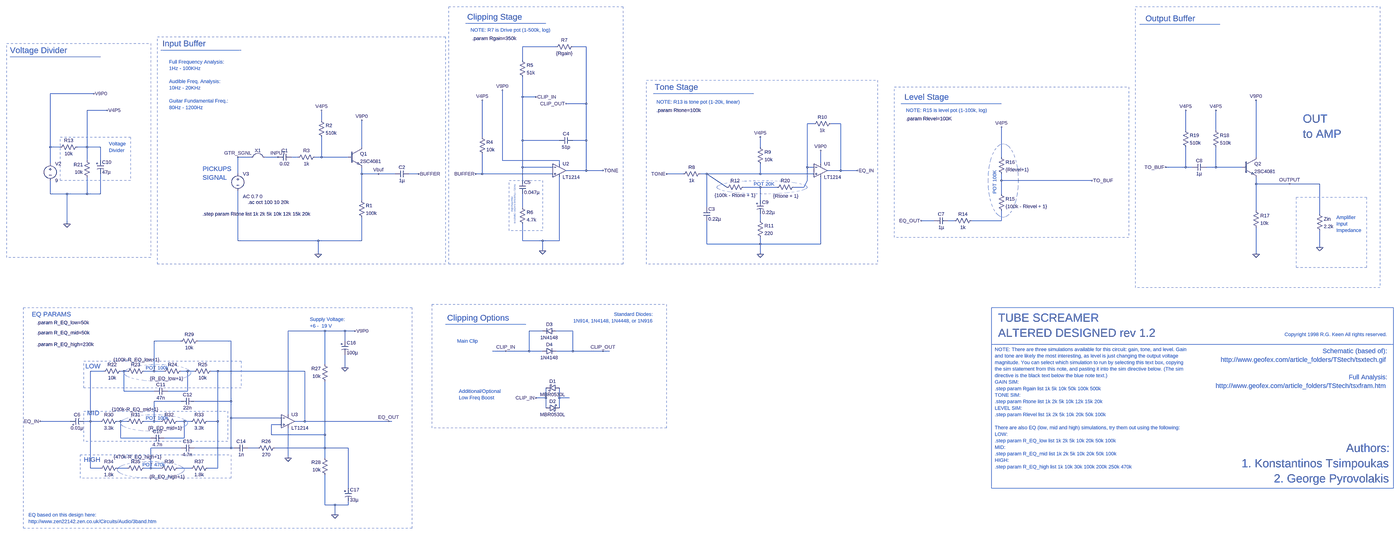
[diagram p0: schematic tube_screamer.asc, whole sheet]
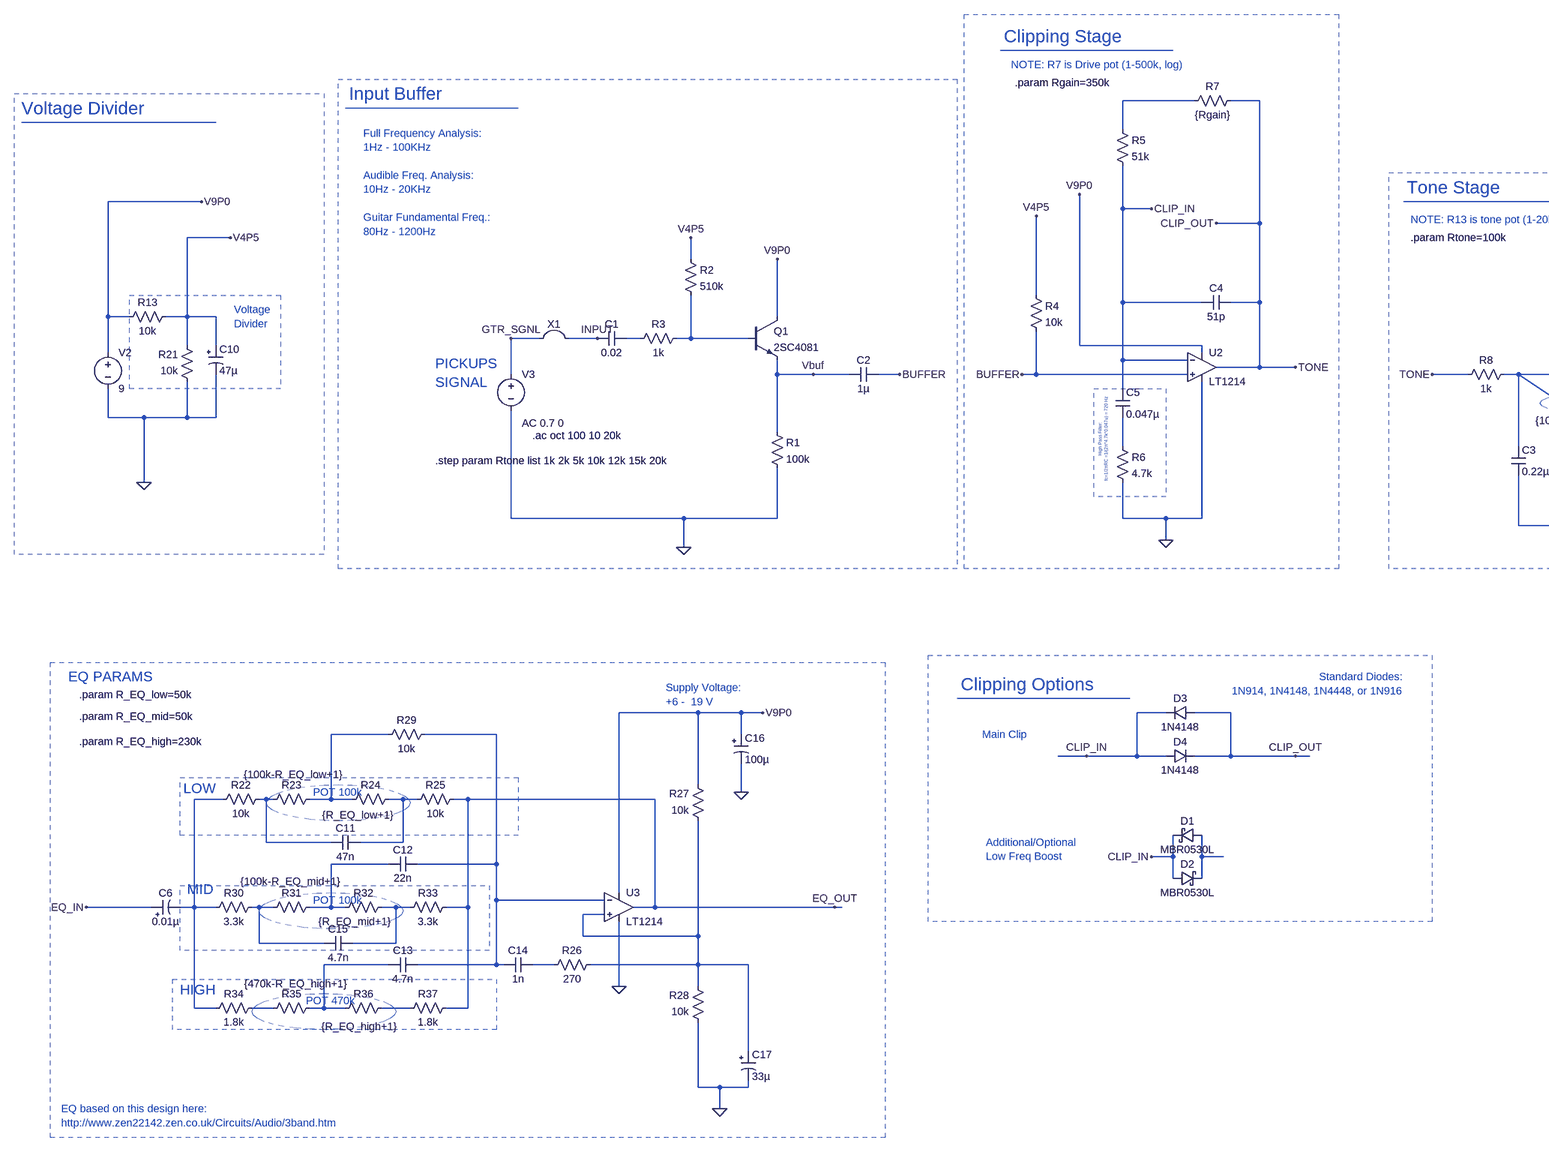
[diagram p1: schematic tube_screamer.asc, part, row 1 of 1, column 1 of 2]
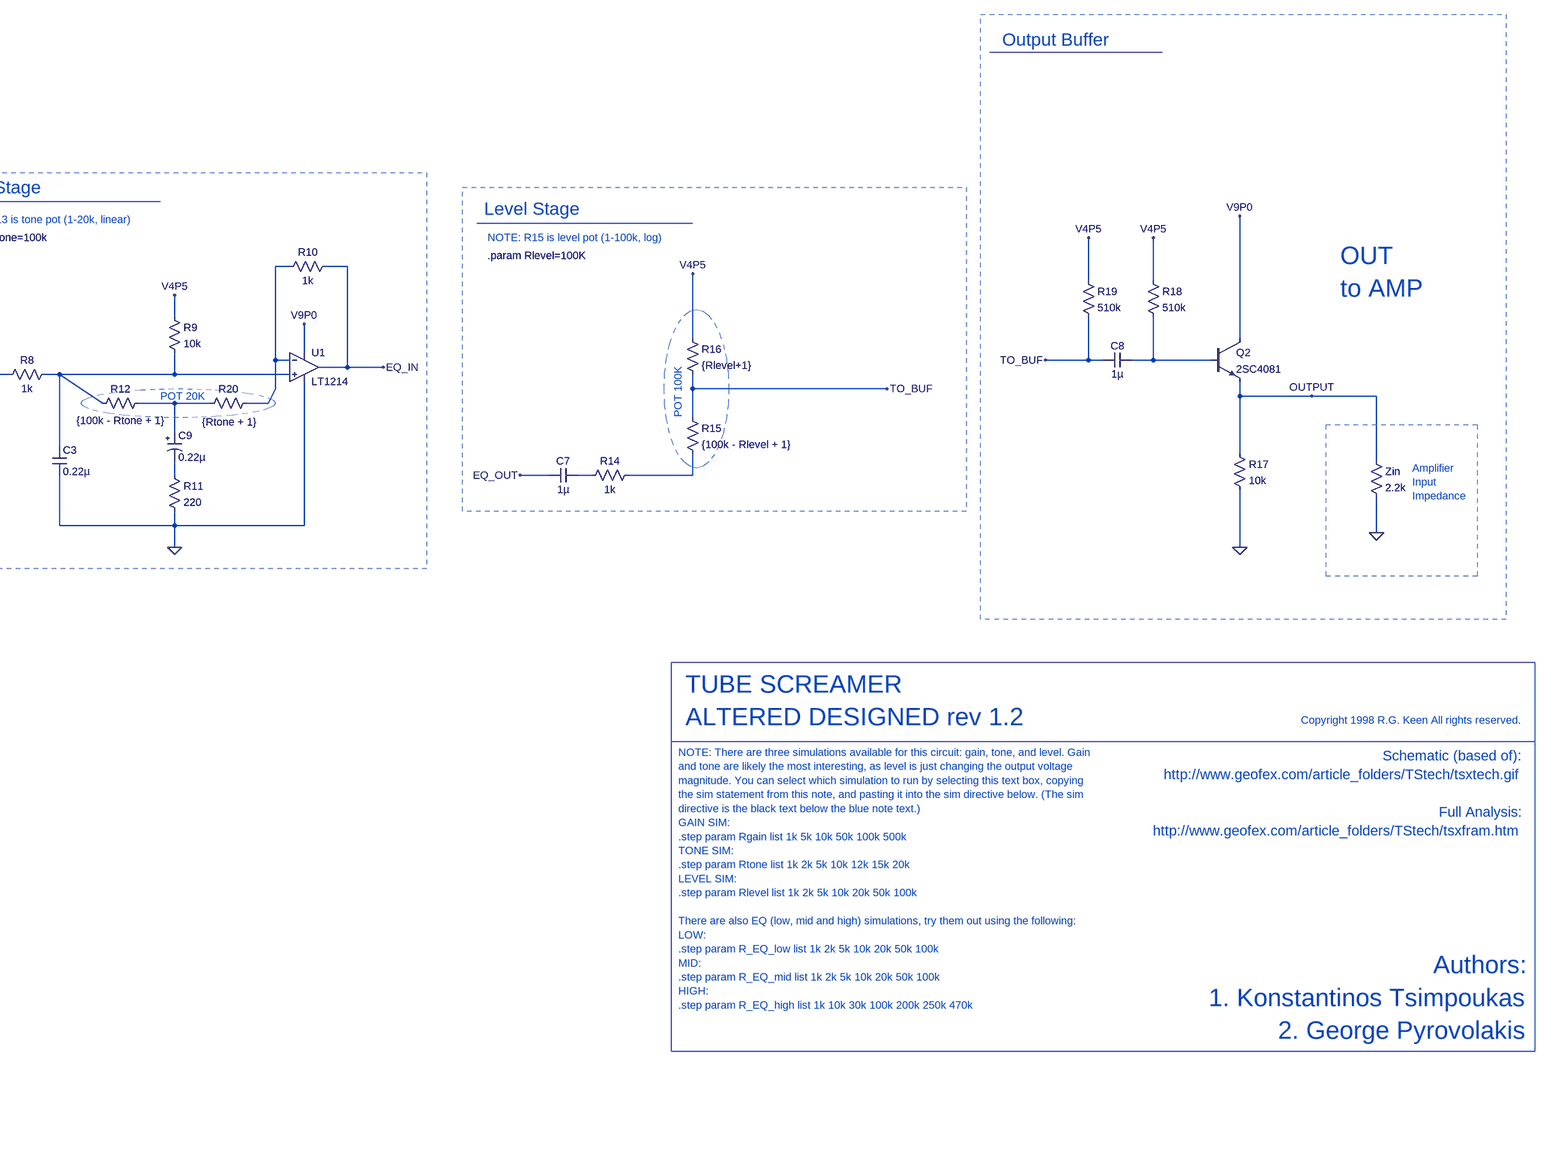
[diagram p2: schematic tube_screamer.asc, part, row 1 of 1, column 2 of 2]
tube_screamer.asc, the LTspice schematic file:
Version 4
SHEET 1 5580 4308
WIRE -1024 848 -1184 848
WIRE -880 848 -944 848
WIRE -1184 912 -1184 848
WIRE -3232 1072 -3440 1072
WIRE -1184 1088 -1184 992
WIRE -1120 1088 -1184 1088
WIRE -880 1120 -880 848
WIRE -880 1120 -976 1120
WIRE -3168 1152 -3264 1152
WIRE -2144 1200 -2144 1152
WIRE 208 1216 176 1216
WIRE 336 1216 288 1216
WIRE 1984 1248 1984 1152
WIRE 2128 1248 2128 1152
WIRE -1376 1280 -1376 1104
WIRE -1184 1296 -1184 1088
WIRE -1008 1296 -1184 1296
WIRE -880 1296 -880 1120
WIRE -880 1296 -944 1296
WIRE -3440 1328 -3440 1072
WIRE -3392 1328 -3440 1328
WIRE -3264 1328 -3264 1152
WIRE -3264 1328 -3312 1328
WIRE -3200 1328 -3264 1328
WIRE -1952 1328 -1952 1200
WIRE -48 1328 -48 1280
WIRE -2480 1376 -2544 1376
WIRE -2352 1376 -2416 1376
WIRE -2256 1376 -2288 1376
WIRE -2144 1376 -2144 1280
WIRE -2144 1376 -2176 1376
WIRE -2016 1376 -2144 1376
WIRE 1104 1376 1104 1232
WIRE 2320 1376 2320 1104
WIRE -3264 1392 -3264 1328
WIRE -3200 1392 -3200 1328
WIRE -1280 1392 -1280 1056
WIRE -1008 1392 -1280 1392
WIRE -3440 1408 -3440 1328
WIRE -1008 1408 -1008 1392
WIRE 240 1408 240 1344
WIRE -1184 1424 -1184 1296
WIRE -1040 1424 -1184 1424
WIRE 176 1424 176 1216
WIRE 208 1424 176 1424
WIRE 1984 1424 1984 1328
WIRE 1984 1424 1888 1424
WIRE 2016 1424 1984 1424
WIRE 2128 1424 2128 1328
WIRE 2128 1424 2080 1424
WIRE 2256 1424 2128 1424
WIRE -880 1440 -880 1296
WIRE -880 1440 -976 1440
WIRE -800 1440 -880 1440
WIRE 336 1440 336 1216
WIRE 336 1440 272 1440
WIRE 416 1440 336 1440
WIRE -2544 1456 -2544 1376
WIRE -1952 1456 -1952 1424
WIRE -1872 1456 -1952 1456
WIRE -1792 1456 -1872 1456
WIRE -1680 1456 -1728 1456
WIRE -1376 1456 -1376 1360
WIRE -1376 1456 -1408 1456
WIRE -1040 1456 -1376 1456
WIRE -416 1456 -496 1456
WIRE -304 1456 -336 1456
WIRE -48 1456 -48 1408
WIRE -48 1456 -304 1456
WIRE 208 1456 -48 1456
WIRE -1184 1488 -1184 1424
WIRE 176 1488 176 1424
WIRE 1104 1488 1104 1456
WIRE 1536 1488 1104 1488
WIRE 2320 1504 2320 1472
WIRE 2480 1504 2320 1504
WIRE 2624 1504 2480 1504
WIRE -208 1520 -304 1456
WIRE -48 1520 -128 1520
WIRE 32 1520 -48 1520
WIRE 160 1520 176 1488
WIRE 160 1520 112 1520
WIRE -3440 1552 -3440 1488
WIRE -3360 1552 -3440 1552
WIRE -3264 1552 -3264 1472
WIRE -3264 1552 -3360 1552
WIRE -3200 1552 -3200 1456
WIRE -3200 1552 -3264 1552
WIRE 1104 1552 1104 1488
WIRE -1952 1584 -1952 1456
WIRE -48 1584 -48 1520
WIRE -1184 1616 -1184 1552
WIRE -304 1616 -304 1456
WIRE 2320 1632 2320 1504
WIRE 2624 1648 2624 1504
WIRE -48 1680 -48 1648
WIRE 784 1680 720 1680
WIRE 880 1680 848 1680
WIRE 1104 1680 1104 1632
WIRE 1104 1680 960 1680
WIRE -3360 1696 -3360 1552
WIRE -2544 1776 -2544 1536
WIRE -2160 1776 -2544 1776
WIRE -1952 1776 -1952 1664
WIRE -1952 1776 -2160 1776
WIRE -1184 1776 -1184 1696
WIRE -1088 1776 -1184 1776
WIRE -1008 1776 -1008 1472
WIRE -1008 1776 -1088 1776
WIRE -304 1792 -304 1680
WIRE -48 1792 -48 1760
WIRE -48 1792 -304 1792
WIRE 240 1792 240 1472
WIRE 240 1792 -48 1792
WIRE 2624 1808 2624 1728
WIRE -1088 1824 -1088 1776
WIRE -2160 1840 -2160 1776
WIRE -48 1840 -48 1792
WIRE 2320 1840 2320 1712
WIRE -2128 2208 -2304 2208
WIRE -2032 2208 -2128 2208
WIRE -1984 2208 -2032 2208
WIRE -1088 2208 -1152 2208
WIRE -944 2208 -1024 2208
WIRE -2816 2256 -2944 2256
WIRE -2576 2256 -2736 2256
WIRE -2032 2256 -2032 2208
WIRE -1264 2304 -1328 2304
WIRE -1152 2304 -1152 2208
WIRE -1152 2304 -1264 2304
WIRE -1088 2304 -1152 2304
WIRE -944 2304 -944 2208
WIRE -944 2304 -1024 2304
WIRE -800 2304 -944 2304
WIRE -768 2304 -800 2304
WIRE -2128 2368 -2128 2208
WIRE -2032 2384 -2032 2320
WIRE -3184 2400 -3248 2400
WIRE -3088 2400 -3104 2400
WIRE -3072 2400 -3088 2400
WIRE -2944 2400 -2944 2256
WIRE -2944 2400 -2992 2400
WIRE -2896 2400 -2944 2400
WIRE -2784 2400 -2816 2400
WIRE -2752 2400 -2784 2400
WIRE -2640 2400 -2672 2400
WIRE -2224 2400 -2640 2400
WIRE -3088 2496 -3088 2400
WIRE -2944 2496 -3088 2496
WIRE -2784 2496 -2784 2400
WIRE -2784 2496 -2880 2496
WIRE -1072 2528 -1072 2480
WIRE -1072 2528 -1120 2528
WIRE -1008 2528 -1008 2480
WIRE -960 2528 -1008 2528
WIRE -2816 2544 -2944 2544
WIRE -2576 2544 -2576 2256
WIRE -2576 2544 -2752 2544
WIRE -1072 2576 -1072 2528
WIRE -1008 2576 -1008 2528
WIRE -2304 2608 -2304 2208
WIRE -2576 2624 -2576 2544
WIRE -2336 2624 -2576 2624
WIRE -3344 2640 -3488 2640
WIRE -3248 2640 -3248 2400
WIRE -3248 2640 -3280 2640
WIRE -3200 2640 -3248 2640
WIRE -3104 2640 -3120 2640
WIRE -3072 2640 -3104 2640
WIRE -2944 2640 -2944 2544
WIRE -2944 2640 -2992 2640
WIRE -2912 2640 -2944 2640
WIRE -2800 2640 -2832 2640
WIRE -2768 2640 -2800 2640
WIRE -2640 2640 -2640 2400
WIRE -2640 2640 -2688 2640
WIRE -2224 2640 -2224 2400
WIRE -2224 2640 -2272 2640
WIRE -1824 2640 -2224 2640
WIRE -1808 2640 -1824 2640
WIRE -2336 2656 -2384 2656
WIRE -2384 2704 -2384 2656
WIRE -2128 2704 -2128 2448
WIRE -2128 2704 -2384 2704
WIRE -3104 2720 -3104 2640
WIRE -2960 2720 -3104 2720
WIRE -2800 2720 -2800 2640
WIRE -2800 2720 -2896 2720
WIRE -2816 2768 -2960 2768
WIRE -2576 2768 -2576 2624
WIRE -2576 2768 -2752 2768
WIRE -2560 2768 -2576 2768
WIRE -2448 2768 -2496 2768
WIRE -2128 2768 -2128 2704
WIRE -2128 2768 -2368 2768
WIRE -2016 2768 -2128 2768
WIRE -2304 2816 -2304 2672
WIRE -2128 2816 -2128 2768
WIRE -3248 2864 -3248 2640
WIRE -3200 2864 -3248 2864
WIRE -3072 2864 -3120 2864
WIRE -2960 2864 -2960 2768
WIRE -2960 2864 -2992 2864
WIRE -2912 2864 -2960 2864
WIRE -2768 2864 -2832 2864
WIRE -2640 2864 -2640 2640
WIRE -2640 2864 -2688 2864
WIRE -2016 2960 -2016 2768
WIRE -2128 3040 -2128 2896
WIRE -2080 3040 -2128 3040
WIRE -2016 3040 -2016 3024
WIRE -2016 3040 -2080 3040
WIRE -2080 3088 -2080 3040
FLAG -2160 1840 0
FLAG -1872 1456 Vbuf
FLAG -800 1440 TONE
FLAG -3232 1072 V9P0
FLAG -1952 1200 V9P0
FLAG -1280 1056 V9P0
FLAG -3168 1152 V4P5
FLAG -2144 1152 V4P5
FLAG -1376 1104 V4P5
FLAG 240 1344 V9P0
FLAG -48 1280 V4P5
FLAG 1104 1232 V4P5
FLAG 2320 1840 0
FLAG 2320 1104 V9P0
FLAG 2128 1152 V4P5
FLAG 1984 1152 V4P5
FLAG -3360 1696 0
FLAG -1680 1456 BUFFER
FLAG -1408 1456 BUFFER
FLAG -496 1456 TONE
FLAG -1088 1824 0
FLAG -48 1840 0
FLAG 416 1440 EQ_IN
FLAG 720 1680 EQ_OUT
FLAG 1536 1488 TO_BUF
FLAG 1888 1424 TO_BUF
FLAG -1120 1088 CLIP_IN
FLAG -800 2304 CLIP_OUT
FLAG -1264 2304 CLIP_IN
FLAG -2304 2816 0
FLAG -2080 3088 0
FLAG -2032 2384 0
FLAG -1824 2640 EQ_OUT
FLAG -3488 2640 EQ_IN
FLAG -2544 1376 GTR_SGNL
FLAG -2352 1376 INPUT
FLAG 2480 1504 OUTPUT
FLAG 2624 1808 0
FLAG -1984 2208 V9P0
FLAG -976 1120 CLIP_OUT
FLAG -1120 2528 CLIP_IN
SYMBOL npn -2016 1328 R0
SYMATTR InstName Q1
SYMATTR Value 2SC4081
SYMBOL res -1968 1568 R0
SYMATTR InstName R1
SYMATTR Value 100k
SYMBOL res -2160 1184 R0
SYMATTR InstName R2
SYMATTR Value 510k
SYMBOL res -2160 1360 R90
WINDOW 0 0 56 VBottom 2
WINDOW 3 32 56 VTop 2
SYMATTR InstName R3
SYMATTR Value 1k
SYMBOL cap -2288 1360 R90
WINDOW 0 0 32 VBottom 2
WINDOW 3 32 32 VTop 2
SYMATTR InstName C1
SYMATTR Value 0.02
SYMBOL cap -1728 1440 R90
WINDOW 0 0 32 VBottom 2
WINDOW 3 32 32 VTop 2
SYMATTR InstName C2
SYMATTR Value 1µ
SYMBOL voltage -3440 1392 R0
WINDOW 123 0 0 Left 0
SYMATTR InstName V2
SYMATTR Value 9
SYMATTR SpiceLine Rser=0
SYMBOL voltage -2544 1440 R0
WINDOW 123 24 124 Left 2
WINDOW 39 0 0 Left 0
WINDOW 3 24 44 Left 2
SYMATTR Value2 AC 0.7 0
SYMATTR Value ""
SYMATTR InstName V3
SYMBOL res -1392 1264 R0
SYMATTR InstName R4
SYMATTR Value 10k
SYMBOL res -1200 896 R0
SYMATTR InstName R5
SYMATTR Value 51k
SYMBOL res -1200 1600 R0
SYMATTR InstName R6
SYMATTR Value 4.7k
SYMBOL cap -1200 1488 R0
SYMATTR InstName C5
SYMATTR Value 0.047µ
SYMBOL res -928 832 R90
WINDOW 0 0 56 VBottom 2
WINDOW 3 32 56 VTop 2
SYMATTR InstName R7
SYMATTR Value {Rgain}
SYMBOL Opamps/LT1214 -1008 1376 R0
SYMATTR InstName U2
SYMBOL res -320 1440 R90
WINDOW 0 0 56 VBottom 2
WINDOW 3 32 56 VTop 2
SYMATTR InstName R8
SYMATTR Value 1k
SYMBOL cap -320 1616 R0
SYMATTR InstName C3
SYMATTR Value 0.22µ
SYMBOL res -64 1312 R0
SYMATTR InstName R9
SYMATTR Value 10k
SYMBOL Opamps/LT1214 240 1376 R0
SYMATTR InstName U1
SYMBOL res 304 1200 R90
WINDOW 0 0 56 VBottom 2
WINDOW 3 32 56 VTop 2
SYMATTR InstName R10
SYMATTR Value 1k
SYMBOL res -64 1664 R0
SYMATTR InstName R11
SYMATTR Value 220
SYMBOL res -112 1504 R90
WINDOW 0 0 56 VBottom 2
WINDOW 3 39 56 VTop 2
SYMATTR InstName R12
SYMATTR Value {100k - Rtone + 1}
SYMBOL cap 784 1696 R270
WINDOW 0 32 32 VTop 2
WINDOW 3 0 32 VBottom 2
SYMATTR InstName C7
SYMATTR Value 1µ
SYMBOL res 864 1696 R270
WINDOW 0 32 56 VTop 2
WINDOW 3 0 56 VBottom 2
SYMATTR InstName R14
SYMATTR Value 1k
SYMBOL res 1088 1536 R0
SYMATTR InstName R15
SYMATTR Value {100k - Rlevel + 1}
SYMBOL res 1088 1360 R0
SYMATTR InstName R16
SYMATTR Value {Rlevel+1}
SYMBOL npn 2256 1376 R0
SYMATTR InstName Q2
SYMATTR Value 2SC4081
SYMBOL res 2304 1616 R0
SYMATTR InstName R17
SYMATTR Value 10k
SYMBOL res 2112 1232 R0
SYMATTR InstName R18
SYMATTR Value 510k
SYMBOL cap 2080 1408 R90
WINDOW 0 0 32 VBottom 2
WINDOW 3 32 32 VTop 2
SYMATTR InstName C8
SYMATTR Value 1µ
SYMBOL res 1968 1232 R0
SYMATTR InstName R19
SYMATTR Value 510k
SYMBOL res 128 1504 R90
WINDOW 0 0 56 VBottom 2
WINDOW 3 42 54 VTop 2
SYMATTR InstName R20
SYMATTR Value {Rtone + 1}
SYMBOL res -3296 1312 R90
WINDOW 0 0 56 VBottom 2
WINDOW 3 32 56 VTop 2
SYMATTR InstName R13
SYMATTR Value 10k
SYMBOL res -3248 1488 R180
WINDOW 0 36 76 Left 2
WINDOW 3 36 40 Left 2
SYMATTR InstName R21
SYMATTR Value 10k
SYMBOL polcap -3216 1392 R0
SYMATTR InstName C10
SYMATTR Value 47µ
SYMATTR SpiceLine V=6.3
SYMBOL polcap -64 1584 R0
SYMATTR InstName C9
SYMATTR Value 0.22µ
SYMATTR SpiceLine V=35V
SYMBOL diode -1024 2192 R90
WINDOW 0 0 32 VBottom 2
WINDOW 3 32 32 VTop 2
SYMATTR InstName D3
SYMATTR Value 1N4148
SYMBOL diode -1088 2320 R270
WINDOW 0 32 32 VTop 2
WINDOW 3 0 32 VBottom 2
SYMATTR InstName D4
SYMATTR Value 1N4148
SYMBOL cap -944 1280 R90
WINDOW 0 0 32 VBottom 2
WINDOW 3 32 32 VTop 2
SYMATTR InstName C4
SYMATTR Value 51p
SYMBOL Opamps\\LT1214 -2304 2576 R0
SYMATTR InstName U3
SYMBOL res -3088 2384 R90
WINDOW 0 0 56 VBottom 2
WINDOW 3 32 56 VTop 2
SYMATTR InstName R22
SYMATTR Value 10k
SYMBOL res -2976 2384 R90
WINDOW 0 0 56 VBottom 2
WINDOW 3 -54 52 VTop 2
SYMATTR InstName R23
SYMATTR Value {100k-R_EQ_low+1}
SYMBOL res -2800 2384 R90
WINDOW 0 0 56 VBottom 2
WINDOW 3 36 84 VTop 2
SYMATTR InstName R24
SYMATTR Value {R_EQ_low+1}
SYMBOL res -2656 2384 R90
WINDOW 0 0 56 VBottom 2
WINDOW 3 32 56 VTop 2
SYMATTR InstName R25
SYMATTR Value 10k
SYMBOL res -2352 2752 R90
WINDOW 0 0 56 VBottom 2
WINDOW 3 32 56 VTop 2
SYMATTR InstName R26
SYMATTR Value 270
SYMBOL res -2112 2464 R180
WINDOW 0 36 76 Left 2
WINDOW 3 36 40 Left 2
SYMATTR InstName R27
SYMATTR Value 10k
SYMBOL res -2112 2912 R180
WINDOW 0 36 76 Left 2
WINDOW 3 36 40 Left 2
SYMATTR InstName R28
SYMATTR Value 10k
SYMBOL res -2832 2272 R270
WINDOW 0 32 56 VTop 2
WINDOW 3 0 56 VBottom 2
SYMATTR InstName R29
SYMATTR Value 10k
SYMBOL res -3104 2624 R90
WINDOW 0 0 56 VBottom 2
WINDOW 3 32 56 VTop 2
SYMATTR InstName R30
SYMATTR Value 3.3k
SYMBOL res -2976 2624 R90
WINDOW 0 0 56 VBottom 2
WINDOW 3 -57 58 VTop 2
SYMATTR InstName R31
SYMATTR Value {100k-R_EQ_mid+1}
SYMBOL res -2816 2624 R90
WINDOW 0 0 56 VBottom 2
WINDOW 3 32 75 VTop 2
SYMATTR InstName R32
SYMATTR Value {R_EQ_mid+1}
SYMBOL res -2672 2624 R90
WINDOW 0 0 56 VBottom 2
WINDOW 3 32 56 VTop 2
SYMATTR InstName R33
SYMATTR Value 3.3k
SYMBOL res -3104 2848 R90
WINDOW 0 0 56 VBottom 2
WINDOW 3 32 56 VTop 2
SYMATTR InstName R34
SYMATTR Value 1.8k
SYMBOL res -2976 2848 R90
WINDOW 0 0 56 VBottom 2
WINDOW 3 -53 46 VTop 2
SYMATTR InstName R35
SYMATTR Value {470k-R_EQ_high+1}
SYMBOL res -2816 2848 R90
WINDOW 0 0 56 VBottom 2
WINDOW 3 42 65 VTop 2
SYMATTR InstName R36
SYMATTR Value {R_EQ_high+1}
SYMBOL res -2672 2848 R90
WINDOW 0 0 56 VBottom 2
WINDOW 3 32 56 VTop 2
SYMATTR InstName R37
SYMATTR Value 1.8k
SYMBOL polcap -3344 2656 R270
WINDOW 0 32 32 VTop 2
WINDOW 3 0 32 VBottom 2
SYMATTR InstName C6
SYMATTR Value 0.01µ
SYMBOL polcap -2048 2256 R0
SYMATTR InstName C16
SYMATTR Value 100µ
SYMBOL polcap -2032 2960 R0
SYMATTR InstName C17
SYMATTR Value 33µ
SYMBOL res 2608 1632 R0
SYMATTR InstName Zin
SYMATTR Value 2.2k
SYMBOL Misc\\jumper -2448 1312 R0
SYMATTR InstName X1
SYMBOL cap -2880 2480 R90
WINDOW 0 0 32 VBottom 2
WINDOW 3 32 32 VTop 2
SYMATTR InstName C11
SYMATTR Value 47n
SYMBOL cap -2752 2528 R90
WINDOW 0 0 32 VBottom 2
WINDOW 3 32 32 VTop 2
SYMATTR InstName C12
SYMATTR Value 22n
SYMBOL cap -2752 2752 R90
WINDOW 0 0 32 VBottom 2
WINDOW 3 32 32 VTop 2
SYMATTR InstName C13
SYMATTR Value 4.7n
SYMBOL cap -2496 2752 R90
WINDOW 0 0 32 VBottom 2
WINDOW 3 32 32 VTop 2
SYMATTR InstName C14
SYMATTR Value 1n
SYMBOL cap -2896 2704 R90
WINDOW 0 0 32 VBottom 2
WINDOW 3 32 32 VTop 2
SYMATTR InstName C15
SYMATTR Value 4.7n
SYMBOL schottky -1008 2464 R90
WINDOW 0 0 32 VBottom 2
WINDOW 3 32 32 VTop 2
SYMATTR InstName D1
SYMATTR Value MBR0530L
SYMATTR Description Diode
SYMATTR Type diode
SYMBOL schottky -1072 2592 R270
WINDOW 0 32 32 VTop 2
WINDOW 3 0 32 VBottom 2
SYMATTR InstName D2
SYMATTR Value MBR0530L
SYMATTR Description Diode
SYMATTR Type diode
TEXT -2904 832 Left 4 ;Input Buffer
TEXT -1448 704 Left 4 ;Clipping Stage
TEXT -1432 768 Left 2 ;NOTE: R7 is Drive pot (1-500k, log)
TEXT -1424 808 Left 2 !.param Rgain=350k
TEXT -552 1040 Left 4 ;Tone Stage
TEXT -544 1112 Left 2 ;NOTE: R13 is tone pot (1-20k, linear)
TEXT -544 1152 Left 2 !.param Rtone=100k
TEXT 648 1152 Left 2 ;NOTE: R15 is level pot (1-100k, log)
TEXT 648 1192 Left 2 !.param Rlevel=100K
TEXT 1792 712 Left 4 ;Output Buffer
TEXT 1072 2296 Left 2 ;NOTE: There are three simulations available for this circuit: gain, tone, and level. Gain \nand tone are likely the most interesting, as level is just changing the output voltage \nmagnitude. You can select which simulation to run by selecting this text box, copying \nthe sim statement from this note, and pasting it into the sim directive below. (The sim \ndirective is the black text below the blue note text.)\nGAIN SIM:\n.step param Rgain list 1k 5k 10k 50k 100k 500k\nTONE SIM:\n.step param Rtone list 1k 2k 5k 10k 12k 15k 20k\nLEVEL SIM:\n.step param Rlevel list 1k 2k 5k 10k 20k 50k 100k\n \nThere are also EQ (low, mid and high) simulations, try them out using the following:\nLOW: \n.step param R_EQ_low list 1k 2k 5k 10k 20k 50k 100k\nMID:\n.step param R_EQ_mid list 1k 2k 5k 10k 20k 50k 100k\nHIGH:\n.step param R_EQ_high list 1k 10k 30k 100k 200k 250k 470k
TEXT -3632 864 Left 4 ;Voltage Divider
TEXT -2712 1432 Left 3 ;PICKUPS\nSIGNAL
TEXT 2952 2304 Right 3 ;Schematic (based of):\nhttp://www.geofex.com/article_folders/TStech/tsxtech.gif\n \nFull Analysis:\nhttp://www.geofex.com/article_folders/TStech/tsxfram.htm
TEXT 2544 1192 Left 5 ;OUT\nto AMP
TEXT 640 1088 Left 4 ;Level Stage
TEXT 1088 2144 Left 5 ;TUBE SCREAMER \nALTERED DESIGNED rev 1.2
TEXT 2960 2768 Right 5 ;Authors:\n1. Konstantinos Tsimpoukas\n2. George Pyrovolakis
TEXT -2496 1592 Left 2 !.ac oct 100 10 20k
TEXT -1544 2144 Left 4 ;Clipping Options
TEXT -560 2128 Right 2 ;Standard Diodes:\n1N914, 1N4148, 1N4448, or 1N916
TEXT 1072 1552 VLeft 2 ;POT 100K
TEXT -80 1504 Left 2 ;POT 20K
TEXT -1240 1600 VTop 0 ;High Pass Filter:\nfc=1/2πRC =1/(2π*4.7k*0.047u) = 720 Hz
TEXT -2984 2384 Left 2 ;POT 100k
TEXT -2984 2624 Left 2 ;POT 100k
TEXT -3000 2848 Left 2 ;POT 470k
TEXT -3504 2168 Left 2 !.param R_EQ_low=50k
TEXT -3504 2216 Left 2 !.param R_EQ_mid=50k
TEXT -3504 2272 Left 2 !.param R_EQ_high=230k
TEXT 2704 1664 Left 2 ;Amplifier\nInput\nImpedance
TEXT -2200 2152 Left 2 ;Supply Voltage: \n+6 -  19 V
TEXT -2712 1648 Left 2 !.step param Rtone list 1k 2k 5k 10k 12k 15k 20k
TEXT -3528 2128 Left 3 ;EQ PARAMS
TEXT -3272 2376 Left 3 ;LOW
TEXT -3264 2600 Left 3 ;MID
TEXT -3280 2824 Left 3 ;HIGH
TEXT -3544 3088 Left 2 ;EQ based on this design here:\nhttp://www.zen22142.zen.co.uk/Circuits/Audio/3band.htm
TEXT -3160 1312 Left 2 ;Voltage \nDivider
TEXT -2872 920 Left 2 ;Full Frequency Analysis:\n1Hz - 100KHz\n \nAudible Freq. Analysis:\n10Hz - 20KHz\n \nGuitar Fundamental Freq.:\n80Hz - 1200Hz
TEXT -1496 2256 Left 2 ;Main Clip
TEXT -1488 2496 Left 2 ;Additional/Optional\nLow Freq Boost
TEXT 2456 2224 Left 2 ;Copyright 1998 R.G. Keen All rights reserved.
LINE Normal 1764 740 2148 740
LINE Normal -1072 736 -1456 736
LINE Normal -2528 864 -2912 864
LINE Normal -80 1072 -560 1072
LINE Normal -3200 896 -3632 896
LINE Normal 1104 1120 624 1120
LINE Normal -1168 2176 -1552 2176
LINE Normal 2976 2272 1056 2272
RECTANGLE Normal -2960 1856 -3648 832 1
RECTANGLE Normal -1552 1888 -2928 800 1
RECTANGLE Normal -704 1888 -1536 656 1
RECTANGLE Normal 512 1888 -592 1008 1
RECTANGLE Normal 1712 1760 592 1040 1
RECTANGLE Normal 2912 2000 1744 656 1
RECTANGLE Normal -1088 1728 -1248 1488 1
RECTANGLE Normal -1712 3152 -3568 2096 1
RECTANGLE Normal 2848 1904 2512 1568 2
RECTANGLE Normal -2528 2480 -3280 2352 4
RECTANGLE Normal -2592 2736 -3280 2592 4
RECTANGLE Normal -2576 2912 -3296 2800 4
RECTANGLE Normal 2976 2960 1056 2096
RECTANGLE Normal -3056 1488 -3392 1280 2
RECTANGLE Normal -496 2672 -1616 2080 1
CIRCLE Normal 1184 1664 1040 1312 1
CIRCLE Normal 176 1552 -256 1488 1
CIRCLE Normal -2768 2448 -3088 2368 2
CIRCLE Normal -2784 2688 -3104 2608 2
CIRCLE Normal -2800 2912 -3120 2832 2

The netlist it stands for:
* tube_screamer.asc
Q1 V9P0 N004 Vbuf 0 2SC4081
R1 Vbuf 0 100k
R2 V4P5 N004 510k
R3 N004 N003 1k
C1 N003 INPUT 0.02
C2 BUFFER Vbuf 1µ
V2 V9P0 0 9 Rser=0
V3 INPUT 0 AC 0.7 0
R4 V4P5 BUFFER 10k
R5 N001 CLIP_IN 51k
R6 N008 0 4.7k
C5 CLIP_IN N008 0.047µ
R7 CLIP_OUT N001 {Rgain}
XU2 BUFFER CLIP_IN V9P0 0 CLIP_OUT LT1213  ; LT1214, pins In+ In- V+ V- OUT
R8 N006 CLIP_OUT 1k
C3 N006 0 0.22µ
R9 V4P5 N006 10k
XU1 N006 N002 V9P0 0 EQ_IN LT1213  ; LT1214, pins In+ In- V+ V- OUT
R10 EQ_IN N002 1k
R11 N009 0 220
R12 N007 N006 {100k - Rtone + 1}
C7 EQ_OUT N010 1µ
R14 N010 N011 1k
R15 TO_BUF N011 {100k - Rlevel + 1}
R16 V4P5 TO_BUF {Rlevel+1}
Q2 V9P0 N005 OUTPUT 0 2SC4081
R17 OUTPUT 0 10k
R18 V4P5 N005 510k
C8 N005 TO_BUF 1µ
R19 V4P5 TO_BUF 510k
R20 N002 N007 {Rtone + 1}
R13 V4P5 V9P0 10k
R21 0 V4P5 10k
C10 V4P5 0 47µ V=6.3
C9 N007 N009 0.22µ V=35V
D3 CLIP_OUT CLIP_IN 1N4148
D4 CLIP_IN CLIP_OUT 1N4148
C4 CLIP_OUT CLIP_IN 51p
XU3 N021 N013 V9P0 0 EQ_OUT LT1213  ; LT1214, pins In+ In- V+ V- OUT
R22 N015 N014 10k
R23 N012 N015 {100k-R_EQ_low+1}
R24 N016 N012 {R_EQ_low+1}
R25 EQ_OUT N016 10k
R26 N021 N023 270
R27 N021 V9P0 10k
R28 0 N021 10k
R29 N012 N013 10k
R30 N019 N014 3.3k
R31 N018 N019 {100k-R_EQ_mid+1}
R32 N020 N018 {R_EQ_mid+1}
R33 EQ_OUT N020 3.3k
R34 N024 N014 1.8k
R35 N022 N024 {470k-R_EQ_high+1}
R36 N025 N022 {R_EQ_high+1}
R37 EQ_OUT N025 1.8k
C6 EQ_IN N014 0.01µ
C16 V9P0 0 100µ
C17 N021 0 33µ
R§Zin OUTPUT 0 2.2k
C11 N016 N015 47n
C12 N013 N018 22n
C13 N013 N022 4.7n
C14 N023 N013 1n
C15 N020 N019 4.7n
D1 N017 CLIP_IN MBR0530L
D2 CLIP_IN N017 MBR0530L
.model D D
.lib standard.dio
.model NPN NPN
.model PNP PNP
.lib standard.bjt
* Input Buffer
* Clipping Stage
* NOTE: R7 is Drive pot (1-500k, log)
.param Rgain=350k
* Tone Stage
* NOTE: R13 is tone pot (1-20k, linear)
.param Rtone=100k
* NOTE: R15 is level pot (1-100k, log)
.param Rlevel=100K
* Output Buffer
* NOTE: There are three simulations available for this circuit: gain, tone, and level. Gain
* and tone are likely the most interesting, as level is just changing the output voltage
* magnitude. You can select which simulation to run by selecting this text box, copying
* the sim statement from this note, and pasting it into the sim directive below. (The sim
* directive is the black text below the blue note text.)
* GAIN SIM:
* .step param Rgain list 1k 5k 10k 50k 100k 500k
* TONE SIM:
* .step param Rtone list 1k 2k 5k 10k 12k 15k 20k
* LEVEL SIM:
* .step param Rlevel list 1k 2k 5k 10k 20k 50k 100k
* There are also EQ (low, mid and high) simulations, try them out using the following:
* LOW:
* .step param R_EQ_low list 1k 2k 5k 10k 20k 50k 100k
* MID:
* .step param R_EQ_mid list 1k 2k 5k 10k 20k 50k 100k
* HIGH:
* .step param R_EQ_high list 1k 10k 30k 100k 200k 250k 470k
* Voltage Divider
* PICKUPS
* SIGNAL
* Schematic (based of):
* http://www.geofex.com/article_folders/TStech/tsxtech.gif
* Full Analysis:
* http://www.geofex.com/article_folders/TStech/tsxfram.htm
* OUT
* to AMP
* Level Stage
* TUBE SCREAMER
* ALTERED DESIGNED rev 1.2
* Authors:
* 1. Konstantinos Tsimpoukas
* 2. George Pyrovolakis
.ac oct 100 10 20k
* Clipping Options
* Standard Diodes:
* 1N914, 1N4148, 1N4448, or 1N916
* POT 100K
* POT 20K
* High Pass Filter:
* fc=1/2πRC =1/(2π*4.7k*0.047u) = 720 Hz
* POT 100k
* POT 100k
* POT 470k
.param R_EQ_low=50k
.param R_EQ_mid=50k
.param R_EQ_high=230k
* Amplifier
* Input
* Impedance
* Supply Voltage:
* +6 -  19 V
.step param Rtone list 1k 2k 5k 10k 12k 15k 20k
* EQ PARAMS
* LOW
* MID
* HIGH
* EQ based on this design here:
* http://www.zen22142.zen.co.uk/Circuits/Audio/3band.htm
* Voltage
* Divider
* Full Frequency Analysis:
* 1Hz - 100KHz
* Audible Freq. Analysis:
* 10Hz - 20KHz
* Guitar Fundamental Freq.:
* 80Hz - 1200Hz
* Main Clip
* Additional/Optional
* Low Freq Boost
* Copyright 1998 R.G. Keen All rights reserved.
.lib LTC.lib
.backanno
.end